# EAGLE design ARM-LPC1115_V0.30A_smd (EAGLE 6.5.0)
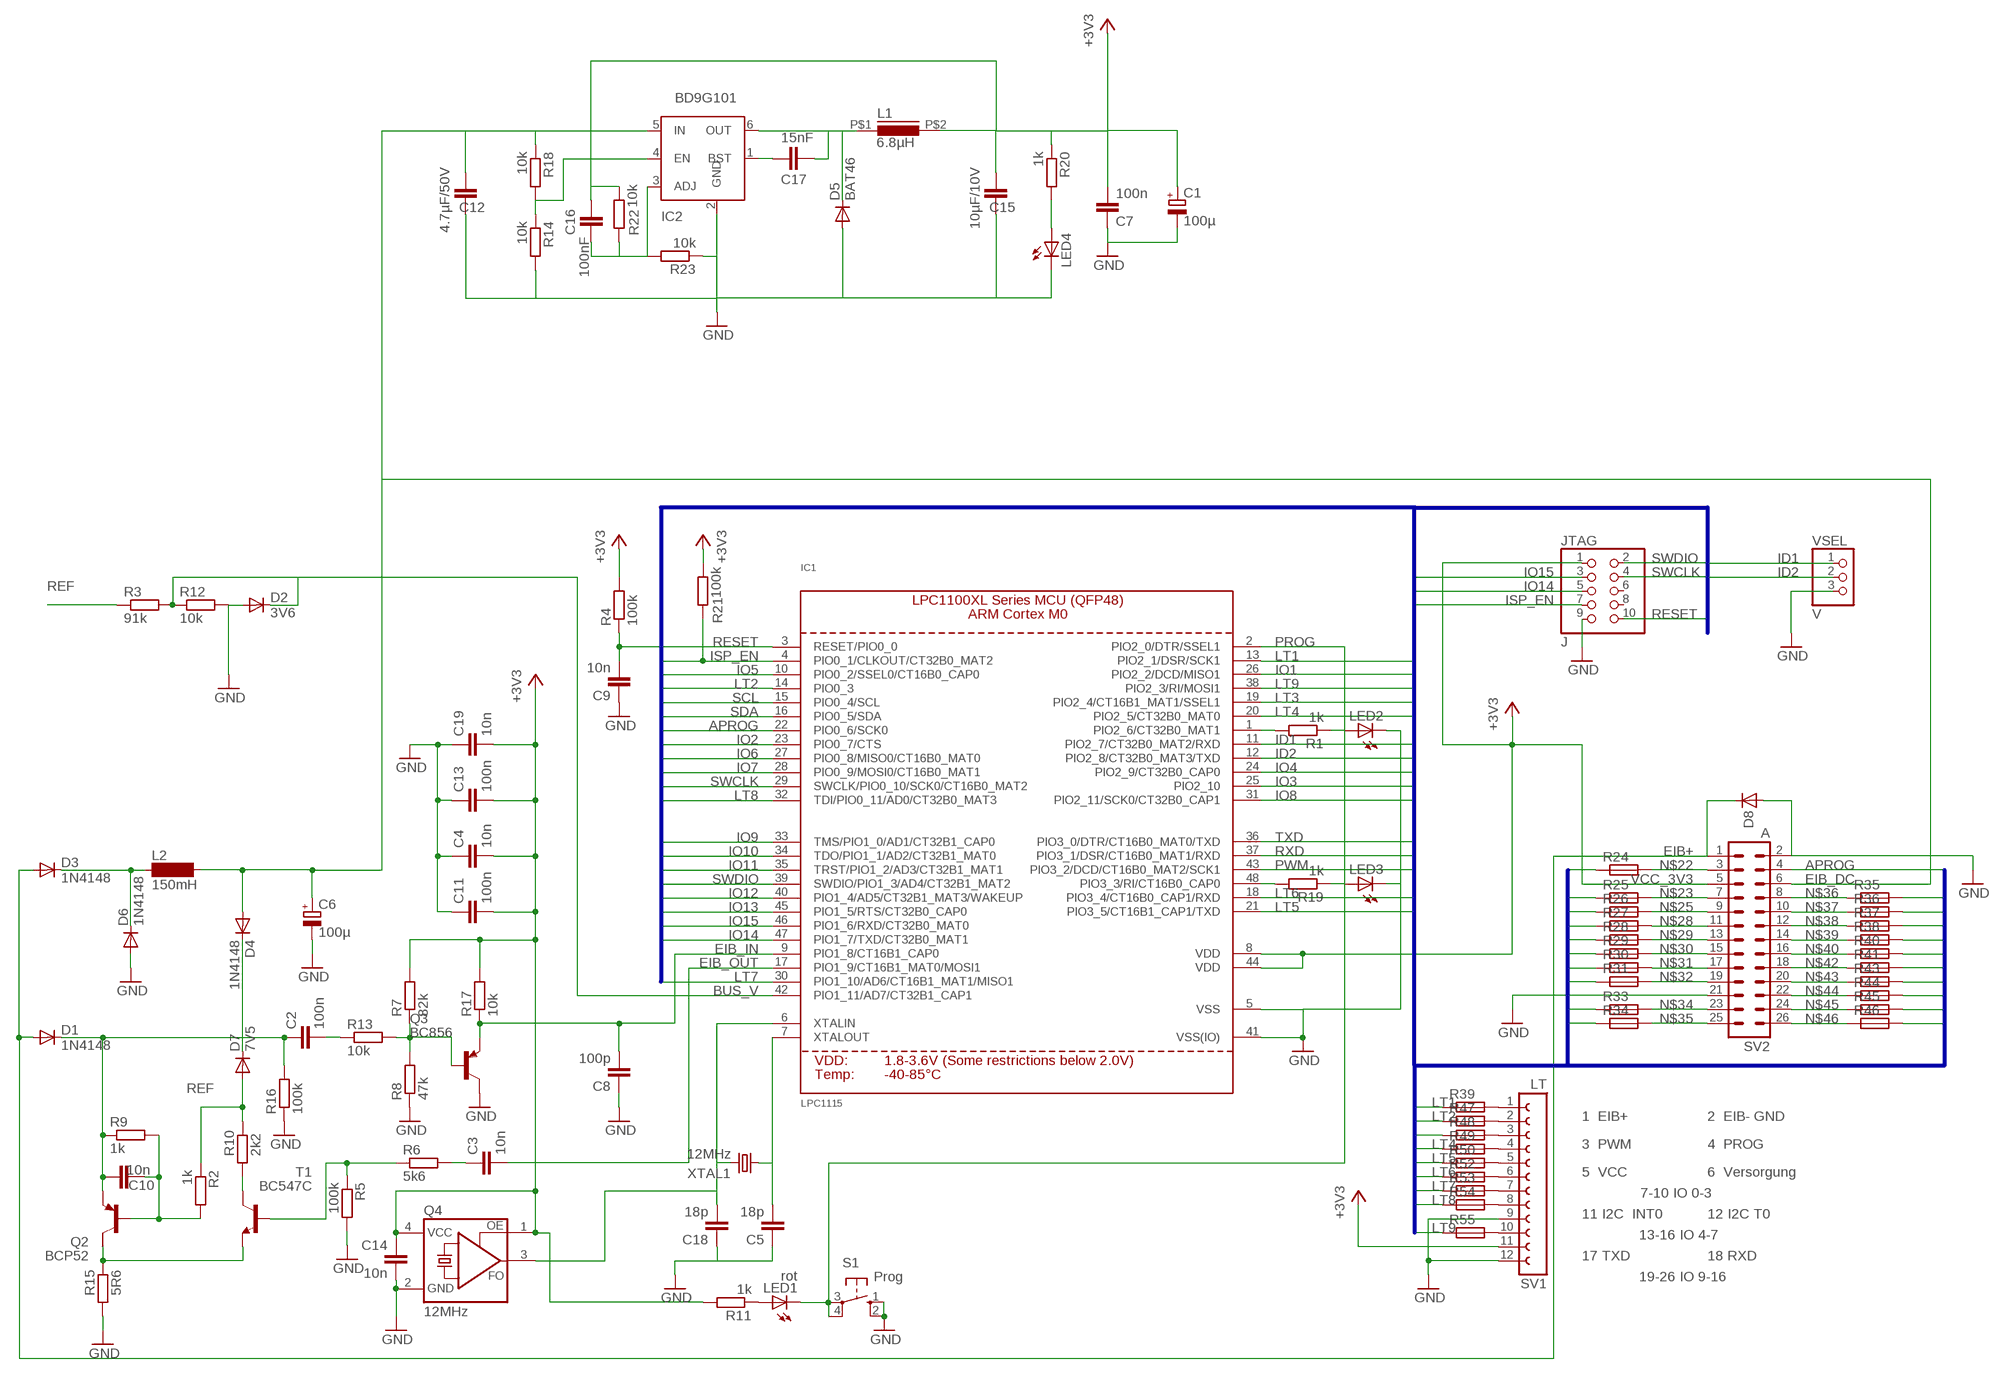
[diagram p0: schematic, sheet 1]

## Parts
C1  100µ  CPOL-EUE5-8.5  [E5-8,5]
C2  100n  C-EUC1206K  [C1206K]
C3  10n  C-EUC1206K  [C1206K]
C4  10n  C-EUC1206  [C1206]
C5  18p  C-EUC0603  [C0603]
C6  100µ  CPOL-EUE5-8.5  [E5-8,5]
C7  100n  C-EUC1206  [C1206]
C8  100p  C-EUC1206K  [C1206K]
C9  10n  C-EUC1206K  [C1206K]
C10  10n  C-EUC1206K  [C1206K]
C11  100n  C-EUC1206  [C1206]
C12  4.7µF/50V  C-EUC1206K  [C1206K]
C13  100n  C-EUC1206  [C1206]
C14  10n  C-EUC1206  [C1206]
C15  10µF/10V  C-EUC1206K  [C1206K]
C16  100nF  C-EUC1206  [C1206]
C17  15nF  C-EUC1206  [C1206]
C18  18p  C-EUC0603  [C0603]
C19  10n  C-EUC1206  [C1206]
D1  1N4148  DIODE-MINIMELF  [MINIMELF]
D2  3V6  DIODE-MINIMELF  [MINIMELF]
D3  1N4148  DIODE-MINIMELF  [MINIMELF]
D4  1N4148  DIODE-MINIMELF  [MINIMELF]
D5  BAT46  DIODE-DO214AC  [DO214AC]
D6  1N4148  DIODE-MINIMELF  [MINIMELF]
D7  7V5  DIODE-MINIMELF  [MINIMELF]
D8  D-SMB  [SMB]
IC1  LPC1115  LPC1113/4/5_QFP48_XLSERIES  [LQFP48]
IC2  BD9G101  BD9G101GBD9G101G-SOT23-6  [SOT23-6]
JTAG  J  PINHD-2X05_2.00  [2X05M]
L1  6.8µH  IND_FASTRON_1616FPS  [PIS2812]
L2  150mH  SD12-1000  [SD12_1000]
LED1  rot  LED3MM  [LED3MM]
LED2  LEDSMT1206  [1206]
LED3  LEDSMT1206  [1206]
LED4  LEDSMT1206  [1206]
Q2  BCP52  FZT753SMD  [SOT223]
Q3  BC856  BC856BSMD  [SOT23-BEC]
Q4  12MHz  ASFL  [ASF]
R1  1k  R-EU_R1206  [R1206]
R2  1k  R-EU_R1206  [R1206]
R3  91k  R-EU_R1206  [R1206]
R4  100k  R-EU_R1206  [R1206]
R5  100k  R-EU_R1206  [R1206]
R6  5k6  R-EU_R1206  [R1206]
R7  82k  R-EU_R1206  [R1206]
R8  47k  R-EU_R1206  [R1206]
R9  1k  R-EU_R1206  [R1206]
R10  2k2  R-EU_R1206  [R1206]
R11  1k  R-EU_R1206  [R1206]
R12  10k  R-EU_R1206  [R1206]
R13  10k  R-EU_R1206  [R1206]
R14  10k  R-EU_R1206  [R1206]
R15  5R6  R-EU_R1206  [R1206]
R16  100k  R-EU_R1206  [R1206]
R17  10k  R-EU_R1206  [R1206]
R18  10k  R-EU_R1206  [R1206]
R19  1k  R-EU_R1206  [R1206]
R20  1k  R-EU_R1206  [R1206]
R21  100k  R-EU_R1206  [R1206]
R22  10k  R-EU_R1206  [R1206]
R23  10k  R-EU_R1206  [R1206]
R24  R-EU_BRIDGER0603  [R0603_BRIDGE]
R25  R-EU_BRIDGER0603  [R0603_BRIDGE]
R26  R-EU_BRIDGER0603  [R0603_BRIDGE]
R27  R-EU_BRIDGER0603  [R0603_BRIDGE]
R28  R-EU_BRIDGER0603  [R0603_BRIDGE]
R29  R-EU_BRIDGER0603  [R0603_BRIDGE]
R30  R-EU_BRIDGER0603  [R0603_BRIDGE]
R31  R-EU_BRIDGER0603  [R0603_BRIDGE]
R33  R-EU_BRIDGER0603  [R0603_BRIDGE]
R34  R-EU_BRIDGER0603  [R0603_BRIDGE]
R35  R-EU_BRIDGER0603  [R0603_BRIDGE]
R36  R-EU_BRIDGER0603  [R0603_BRIDGE]
R37  R-EU_BRIDGER0603  [R0603_BRIDGE]
R38  R-EU_BRIDGER0603  [R0603_BRIDGE]
R39  R-EU_BRIDGER0603  [R0603_BRIDGE]
R40  R-EU_BRIDGER0603  [R0603_BRIDGE]
R41  R-EU_BRIDGER0603  [R0603_BRIDGE]
R43  R-EU_BRIDGER0603  [R0603_BRIDGE]
R44  R-EU_BRIDGER0603  [R0603_BRIDGE]
R45  R-EU_BRIDGER0603  [R0603_BRIDGE]
R46  R-EU_BRIDGER0603  [R0603_BRIDGE]
R47  R-EU_BRIDGER0603  [R0603_BRIDGE]
R48  R-EU_BRIDGER0603  [R0603_BRIDGE]
R49  R-EU_BRIDGER0603  [R0603_BRIDGE]
R50  R-EU_BRIDGER0603  [R0603_BRIDGE]
R52  R-EU_BRIDGER0603  [R0603_BRIDGE]
R53  R-EU_BRIDGER0603  [R0603_BRIDGE]
R54  R-EU_BRIDGER0603  [R0603_BRIDGE]
R55  R-EU_BRIDGER0603  [R0603_BRIDGE]
S1  Prog  10-XX  [B3F-10XX]
SV1  LT  FE12-1  [FE12]
SV2  A  ML26  [ML26]
T1  BC547C  BC847  [SOT23]
VSEL  V  HEADER-1X3ROUND  [1X03_ROUND]
XTAL1  12MHz  CRYSTALHC49S  [HC49/S]

## Nets
APROG: IC1.22(PIO0_6/SCK0) SV2.4
BUS_V: D2.C IC1.42(PIO1_11/AD7/CT32B1_CAP1) R3.2 R12.1
DRAIN: C2.1 C10.1 D1.C Q2.3(E) R9.1 R16.2
EIB+: D1.A D3.A D8.1(C) SV2.1
EIB_DC: C6.+ C12.2 D4.A IC2.5(IN) L2.2 R18.1 SV2.6
EIB_IN: C8.2 IC1.9(PIO1_8/CT16B1_CAP0) Q3.E R17.1
EIB_OUT: C3.2 IC1.17(PIO1_9/CT16B1_MAT0/MOSI1)
GND: C1.- C4.1 C5.1 C6.- C7.1 C8.1 C9.1 C11.1 C12.1 C13.1 C14.2 C15.1 C18.1 C19.1 D2.A D5.A D6.A D8.2(A) IC1.5(VSS) IC1.41(VSS(IO)) IC2.2(GND) JTAG.9 LED2.C LED3.C LED4.C Q3.C Q4.2(GND) R5.2 R8.1 R12.2 R14.2 R15.1 R16.1 R23.1 S1.1(S) S1.2(S1) SV1.9 SV1.12 SV2.2 SV2.21 VSEL.3
ID1: IC1.11(PIO2_7/CT32B0_MAT2/RXD) VSEL.1
ID2: IC1.12(PIO2_8/CT32B0_MAT3/TXD) VSEL.2
IO1: IC1.26(PIO2_2/DCD/MISO1) R25.1
IO2: IC1.23(PIO0_7/CTS) R35.2
IO3: IC1.25(PIO2_10) R26.1
IO4: IC1.24(PIO2_9/CT32B0_CAP0) R36.2
IO5: IC1.10(PIO0_2/SSEL0/CT16B0_CAP0) R28.1
IO6: IC1.27(PIO0_8/MISO0/CT16B0_MAT0) R38.2
IO7: IC1.28(PIO0_9/MOSI0/CT16B0_MAT1) R29.1
IO8: IC1.31(PIO2_11/SCK0/CT32B0_CAP1) R40.2
IO9: IC1.33(TMS/PIO1_0/AD1/CT32B1_CAP0) R31.1
IO10: IC1.34(TDO/PIO1_1/AD2/CT32B1_MAT0) R43.2
IO11: IC1.35(TRST/PIO1_2/AD3/CT32B1_MAT1) R44.2
IO12: IC1.40(PIO1_4/AD5/CT32B1_MAT3/WAKEUP) R33.1
IO13: IC1.45(PIO1_5/RTS/CT32B0_CAP0) R45.2
IO14: IC1.47(PIO1_7/TXD/CT32B0_MAT1) JTAG.5 R34.1
IO15: IC1.46(PIO1_6/RXD/CT32B0_MAT0) JTAG.3 R46.2
ISP_EN: IC1.4(PIO0_1/CLKOUT/CT32B0_MAT2) JTAG.7 R21.1
LT1: IC1.13(PIO2_1/DSR/SCK1) R39.1
LT2: IC1.14(PIO0_3) R47.1
LT3: IC1.19(PIO2_4/CT16B1_MAT1/SSEL1) R48.1
LT4: IC1.20(PIO2_5/CT32B0_MAT0) R49.1
LT5: IC1.21(PIO3_5/CT16B1_CAP1/TXD) R50.1
LT6: IC1.18(PIO3_4/CT16B0_CAP1/RXD) R52.1
LT7: IC1.30(PIO1_10/AD6/CT16B1_MAT1/MISO1) R53.1
LT8: IC1.32(TDI/PIO0_11/AD0/CT32B0_MAT3) R54.1
LT9: IC1.38(PIO2_3/RI/MOSI1) R55.1
LX: C17.1 D5.C IC2.6(OUT) L1.P$1
N$1: C3.1 R6.2
N$2: C2.2 R13.1
N$3: C5.2 IC1.7(XTALOUT) XTAL1.1
N$4: IC1.1(PIO2_6/CT32B0_MAT1) R1.2
N$5: IC1.48(PIO3_3/RI/CT16B0_CAP0) R19.2
N$6: R10.1 T1.3(C)
N$7: Q2.2(C) R15.2 T1.2(E)
N$8: D3.C D6.C L2.1
N$9: D4.C D7.C
N$10: LED2.A R1.1
N$11: LED3.A R19.1
N$12: R5.1 R6.1 T1.1(B)
N$13: LED4.A R20.2
N$14: Q3.B R7.1 R8.2 R13.2
N$15: C10.2 Q2.1(B) R2.2 R9.2
N$17: C18.2 IC1.6(XTALIN) Q4.3(FO) XTAL1.2
N$19: C17.2 IC2.1(BST)
N$20: IC2.4(EN) R14.1 R18.2
N$22: R24.2 SV2.3
N$23: R25.2 SV2.7
N$24: C16.1 IC2.3(ADJ) R22.1 R23.2
N$25: R26.2 SV2.9
N$28: R27.2 SV2.11
N$29: R28.2 SV2.13
N$30: R29.2 SV2.15
N$31: R30.2 SV2.17
N$32: R31.2 SV2.19
N$34: R33.2 SV2.23
N$35: R34.2 SV2.25
N$36: R35.1 SV2.8
N$37: R36.1 SV2.10
N$38: R37.1 SV2.12
N$39: R38.1 SV2.14
N$40: R40.1 SV2.16
N$41: LED1.A R11.1
N$42: R41.1 SV2.18
N$43: R43.1 SV2.20
N$44: R44.1 SV2.22
N$45: R45.1 SV2.24
N$46: R46.1 SV2.26
N$47: R39.2 SV1.1
N$48: R47.2 SV1.2
N$49: R48.2 SV1.3
N$50: R49.2 SV1.4
N$51: R50.2 SV1.5
N$52: R52.2 SV1.6
N$53: R53.2 SV1.7
N$54: R54.2 SV1.8
N$55: R55.2 SV1.10
PROG: IC1.2(PIO2_0/DTR/SSEL1) LED1.K(C) S1.3(P) S1.4(P1)
PWM: IC1.43(PIO3_2/DCD/CT16B0_MAT2/SCK1) R24.1
REF: D7.A R2.1 R3.1 R10.2
RESET: C9.2 IC1.3(RESET/PIO0_0) JTAG.10 R4.1
RXD: IC1.37(PIO3_1/DSR/CT16B0_MAT1/RXD) R41.2
SCL: IC1.15(PIO0_4/SCL) R37.2
SDA: IC1.16(PIO0_5/SDA) R27.1
SWCLK: IC1.29(SWCLK/PIO0_10/SCK0/CT16B0_MAT2) JTAG.4
SWDIO: IC1.39(SWDIO/PIO1_3/AD4/CT32B1_MAT2) JTAG.2
TXD: IC1.36(PIO3_0/DTR/CT16B0_MAT0/TXD) R30.1
VCC_3V3: C1.+ C4.2 C7.2 C11.2 C13.2 C14.1 C15.2 C16.2 C19.2 IC1.8(VDD) IC1.44(VDD) JTAG.1 L1.P$2 Q4.1(OE) Q4.4(VCC) R4.2 R7.2 R11.2 R17.2 R20.1 R21.2 R22.2 SV1.11 SV2.5 ; supply symbol labelled +3V3
Unconnected: JTAG.6 JTAG.8 Q2.4(C/)

## Buses
IO[1..15],LT[1..9],SCL,SDA,PWM,APROG,RXD,TXD,RESET,SWCLK,SWDIO,ISP_EN,ID1,ID2

## Notes on the sheet
- 1  EIB+ | 2  EIB- GND
- 3  PWM | 4  PROG
- 5  VCC | 6  Versorgung
- 7-10 IO 0-3
- 11 I2C  INT0 | 12 I2C T0
- 13-16 IO 4-7
- 17 TXD | 18 RXD
- 19-26 IO 9-16

## Library data of the parts
C1 C6 = rcl:CPOL-EU: POLARIZED CAPACITOR, European symbol
C2-C5 C7-C19 = rcl:C-EU: CAPACITOR, European symbol
D1-D7 = diode:DIODE-: DIODE
D8 = semicon-smd-ipc:D-: DIODE unfilled
IC1 = microbuilder:LPC1113/4/5_QFP48_XLSERIES: LPC1113/4/5 ARM Cortex M0 MCU (50MHz) - XL Series (FBD48/3x3) LPC1115FBD48/303: Max Frequency: 50MHz Flash: 64kB SRAM: 8kB ADC: 10-bit
IC2 = Stefan_selfbus:BD9G101G
JTAG = pinhead-2:PINHD-2X05: PIN HEADER
L1 = Stefan_selfbus:IND_FASTRON_1616FPS
L2 = inductor-neosid:SD12: INDUCTOR nominal inductance
LED1-LED4 = led:LED: LED OSRAM: - CHIPLED LG R971, LG N971, LY N971, LG Q971, LY Q971, LO R971, LY R971 LH N974, LH R974 LS Q976, LO Q976, LY Q976 LO Q996 - Hyper CHIPLED LW Q18S LB Q993, LB Q99A, LB R99A - SideLED LS A670, LO A670, LY A670, LG A670, LP A670 LB A673, LV A673, LT A673, LW A673 LH A674 LY A675 LS A676, LA A676, LO A676, LY A676, LW A676 LS A679, LY A679, LG A679 - Hyper Micro SIDELED® LS Y876, LA Y876, LO Y876, LY Y876 LT Y87S - SmartLED LW L88C, LW L88S LB L89C, LB L89S, LG L890 LS L89K, LO L89K, LY L89K LS L896, LA L896, LO L896, LY L896 - TOPLED LS T670, LO T670, LY T670, LG T670, LP T670 LSG T670, LSP T670, LSY T670, LOP T670, LYG T670 LG T671, LOG T671, LSG T671 LB T673, LV T673, LT T673, LW T673 LH T674 LS T676, LA T676, LO T676, LY T676, LB T676, LH T676, LSB T676, LW T676 LB T67C, LV T67C, LT T67C, LS T67K, LO T67K, LY T67K, LW E67C LS E67B, LA E67B, LO E67B, LY E67B, LB E67C, LV E67C, LT E67C LW T67C LS T679, LY T679, LG T679 LS T770, LO T770, LY T770, LG T770, LP T770 LB T773, LV T773, LT T773, LW T773 LH T774 LS E675, LA E675, LY E675, LS T675 LS T776, LA T776, LO T776, LY T776, LB T776 LHGB T686 LT T68C, LB T68C - Hyper Mini TOPLED® LB M676 - Mini TOPLED Santana® LG M470 LS M47K, LO M47K, LY M47K Source: http://www.osram.convergy.de - LUMILED® LXK2-PW12-R00, LXK2-PW12-S00, LXK2-PW14-U00, LXK2-PW14-V00 LXK2-PM12-R00, LXK2-PM12-S00, LXK2-PM14-U00 LXK2-PE12-Q00, LXK2-PE12-R00, LXK2-PE12-S00, LXK2-PE14-T00, LXK2-PE14-U00 LXK2-PB12-K00, LXK2-PB12-L00, LXK2-PB12-M00, LXK2-PB14-N00, LXK2-PB14-P00, LXK2-PB14-Q00 LXK2-PR12-L00, LXK2-PR12-M00, LXK2-PR14-Q00, LXK2-PR14-R00 LXK2-PD12-Q00, LXK2-PD12-R00, LXK2-PD12-S00 LXK2-PH12-R00, LXK2-PH12-S00 LXK2-PL12-P00, LXK2-PL12-Q00, LXK2-PL12-R00 Source: www.luxeon.com
Q2 = transistor-pnp:FZT753SMD: PNP Transistor
Q3 = transistor-pnp:BC856*: PNP Transistror
Q4 = crystal:ASF*: CRYSTAL CLOCK OSCILLATORS 5.0 Vdc or 3.3 Vdc - LOW PROFILE ULTRA MINIATURE CERAMIC SURFACE MOUNT Source: http://www.abracon.com/Oscillators/asf1-L-L1.pdf
R1-R23 = rcl:R-EU_: RESISTOR, European symbol
R24-R31 R33-R41 R43-R50 R52-R55 = Stefan_selfbus:R-EU_BRIDGE: RESISTOR, European symbol
S1 = switch-omron:10-XX: OMRON SWITCH
SV1 = con-lsta:FE12-1: FEMALE HEADER; OC_FARNELL: unknown; OC_NEWARK: unknown
SV2 = con-harting-ml:ML26: HARTING; OC_FARNELL: unknown; OC_NEWARK: unknown
T1 = transistor:BC847: NPN TRANSISTOR
VSEL = microbuilder:HEADER-1X3: PIN HEADER
XTAL1 = crystal:CRYSTAL: CRYSTAL

## Board
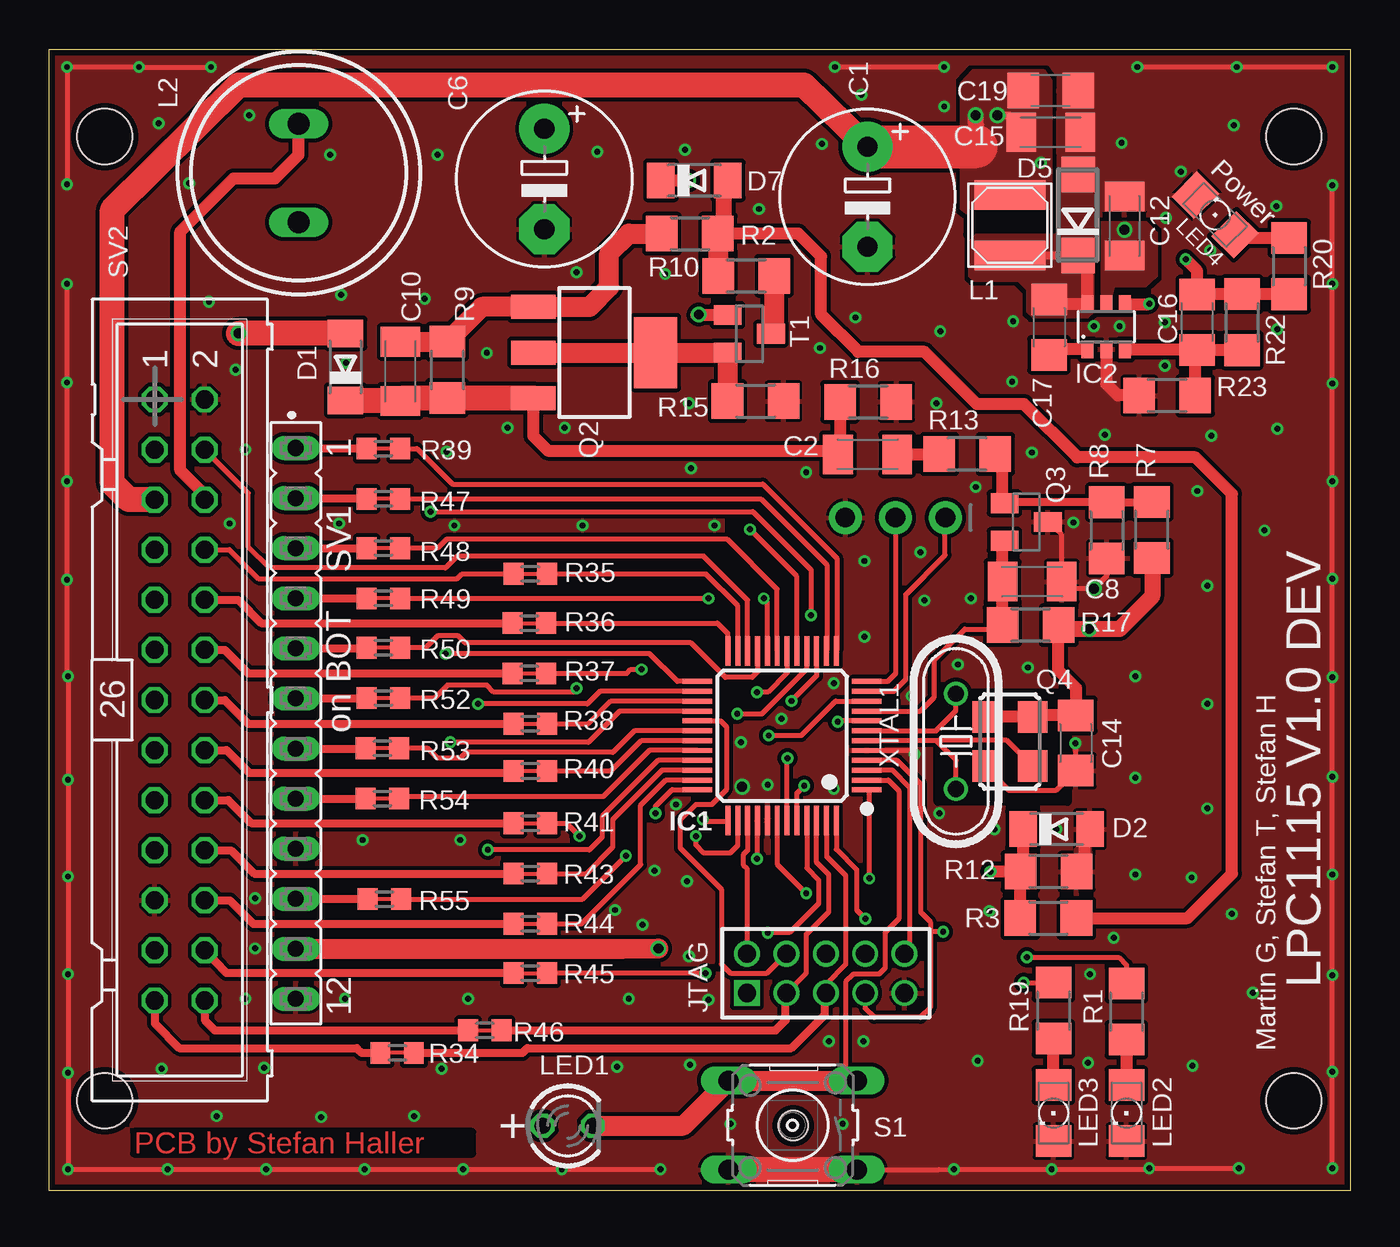
[diagram p1: board, top side]
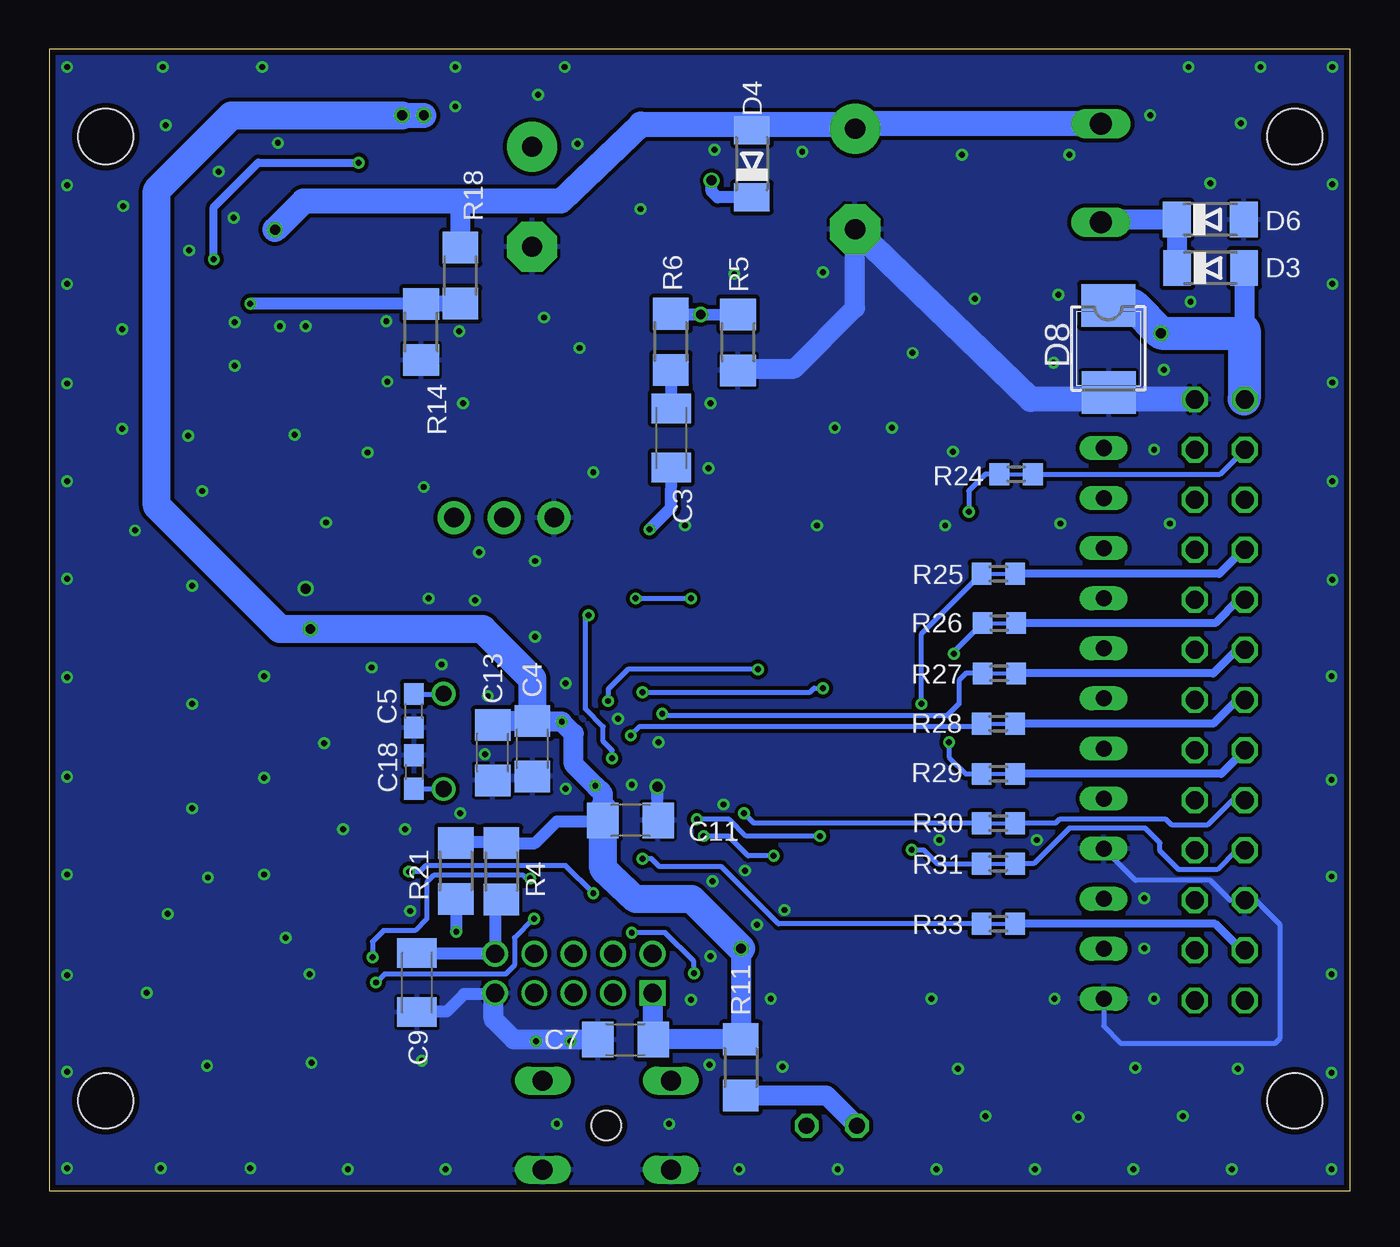
[diagram p2: board, bottom side, seen from below]

Size 66 x 57.9 mm. Coordinates in mm from the lower left corner, seen from the top.
Outline: 66,0 0,0 0,57.9 66,57.9 66,0
Copper layers (1*16): Top 0.035mm / dielectric 1.5mm / Bottom 0.035mm
Design rules "default *": minimum track width 0.16mm, minimum drill 0.3mm, track to track 0.16mm, track to pad 0.16mm, pad to pad 0.16mm, via to via 0.16mm, smd to smd 0.16mm, copper to edge 0.3mm, drill to drill 0.2mm, minimum pad ring 0.2mm, minimum via ring 0.15mm, stop-mask expansion 0.075mm, vias tented up to drill 0mil, thermal gap 0.15mm
Holes 2.8 mm at 2.81,53.48 63.14,53.48 63.14,4.58 2.81,4.58
Holes 1.5 mm at 37.73,3.31
tRestrict: area 45.1,19.7 to 51.7,25.3; area 34.6,31.1 to 37.6,34.1; area 42.5,24.8 to 42.9,24.9; area 46.7,48.5 to 50.8,49.6

### Footprints (pad centres in the part's own frame; a part is rotated, then mirrored left to right if it is on the bottom)
E5-8,5 = drill 1.016 pad 2.54: + -2.54,0 | drill 1.016 pad 2.54 octagon: - 2.54,0
C1206K = smd 1.5 x 2: 1 -1.5,0; 2 1.5,0
C1206 = smd 1.6 x 1.8: 1 -1.4,0; 2 1.4,0
C0603 = smd 1.1 x 1: 1 -0.85,0; 2 0.85,0
MINIMELF = smd 1.4 x 1.8: A 1.7,0; C -1.7,0
DO214AC = smd 1.8 x 1.7: A 2.05,0; C -2.05,0
SMB = smd 2.159 x 2.743: 1 -2.311,-0.127; 2 2.108,-0.102
LQFP48 = smd 1.5 x 0.25: 1 -4.3,2.75; 2 -4.3,2.25; 3 -4.3,1.75; 4 -4.3,1.25; 5 -4.3,0.75; 6 -4.3,0.25; 7 -4.3,-0.25; 8 -4.3,-0.75; 9 -4.3,-1.25; 10 -4.3,-1.75; 11 -4.3,-2.25; 12 -4.3,-2.75; 25 4.3,-2.75; 26 4.3,-2.25; 27 4.3,-1.75; 28 4.3,-1.25; 29 4.3,-0.75; 30 4.3,-0.25; 31 4.3,0.25; 32 4.3,0.75; 33 4.3,1.25; 34 4.3,1.75; 35 4.3,2.25; 36 4.3,2.75 | smd 0.25 x 1.5: 13 -2.75,-4.3; 14 -2.25,-4.3; 15 -1.75,-4.3; 16 -1.25,-4.3; 17 -0.75,-4.3; 18 -0.25,-4.3; 19 0.25,-4.3; 20 0.75,-4.3; 21 1.25,-4.3; 22 1.75,-4.3; 23 2.25,-4.3; 24 2.75,-4.3; 37 2.75,4.3; 38 2.25,4.3; 39 1.75,4.3; 40 1.25,4.3; 41 0.75,4.3; 42 0.25,4.3; 43 -0.25,4.3; 44 -0.75,4.3; 45 -1.25,4.3; 46 -1.75,4.3; 47 -2.25,4.3; 48 -2.75,4.3
SOT23-6 = smd 0.6 x 0.9: 1 -0.95,-1.15; 2 0,-1.15; 3 0.95,-1.15; 4 0.95,1.15; 5 0,1.15; 6 -0.95,1.15
2X05M = drill 0.914 square: 1 -4,-1 | drill 0.914: 2 -4,1; 3 -2,-1; 4 -2,1; 5 0,-1; 6 0,1; 7 2,-1; 8 2,1; 9 4,-1; 10 4,1
PIS2812 = smd 3.6 x 1.5: P$1 0,1.525; P$2 0,-1.525
SD12_1000 = drill 1.1 long: 1 -2.5,0; 2 2.5,0
LED3MM = drill 0.813 octagon: A -1.27,0; K 1.27,0
1206 = smd 1.6 x 1.803: A -1.422,0; C 1.422,0
SOT223 = smd 1.219 x 2.235: 1 -2.311,-3.099; 2 0,-3.099; 3 2.311,-3.099 | smd 3.6 x 2.2: 4 0,3.099
SOT23-BEC = smd 1 x 1.4: B -0.95,-1.1; C 0,1.1; E 0.95,-1.1
ASF = smd 1.6 x 1.5: 1 -1.25,-1.15; 2 1.25,-1.15; 3 1.25,1.15; 4 -1.25,1.15
R1206 = smd 1.6 x 1.803: 1 -1.422,0; 2 1.422,0
R0603_BRIDGE = smd 1 x 1.1: 1 -0.85,0; 2 0.85,0
B3F-10XX = drill 1.016 long: 1 -3.251,2.261; 2 3.251,2.261; 3 -3.251,-2.261; 4 3.251,-2.261
FE12 = drill 0.813 long: 1 -13.97,0; 2 -11.43,0; 3 -8.89,0; 4 -6.35,0; 5 -3.81,0; 6 -1.27,0; 7 1.27,0; 8 3.81,0; 9 6.35,0; 10 8.89,0; 11 11.43,0; 12 13.97,0
ML26 = drill 0.914 octagon: 1 -15.24,-1.27; 2 -15.24,1.27; 3 -12.7,-1.27; 4 -12.7,1.27; 5 -10.16,-1.27; 6 -10.16,1.27; 7 -7.62,-1.27; 8 -7.62,1.27; 9 -5.08,-1.27; 10 -5.08,1.27; 11 -2.54,-1.27; 12 -2.54,1.27; 13 0,-1.27; 14 0,1.27; 15 2.54,-1.27; 16 2.54,1.27; 17 5.08,-1.27; 18 5.08,1.27; 19 7.62,-1.27; 20 7.62,1.27; 21 10.16,-1.27; 22 10.16,1.27; 23 12.7,-1.27; 24 12.7,1.27; 25 15.24,-1.27; 26 15.24,1.27
SOT23 = smd 1 x 1.4: 1 -0.95,-1.1; 2 0.95,-1.1; 3 0,1.1
1X03_ROUND = drill 1 pad 1.676: 1 -2.54,0; 2 0,0; 3 2.54,0
HC49/S = drill 0.813: 1 -2.413,0; 2 2.413,0

### Placement (x,y rotation side)
C1  41.51,50.43 270 top
C2  41.51,37.35 0 top
C3  34.44,38.19 270 bottom
C4  41.48,22.43 90 bottom
C5  47.5,24.35 90 bottom
C6  25.11,51.32 270 top
C7  36.77,7.68 0 bottom
C8  49.86,30.9 180 top
C9  47.35,10.57 90 bottom
C10  17.81,41.57 90 top
C11  36.51,18.79 180 bottom
C12  54.55,48.94 270 top
C13  43.5,22.23 90 bottom
C14  52.08,22.72 270 top
C15  50.8,53.69 180 top
C16  58.24,44.06 90 top
C17  50.72,43.8 270 top
C18  47.5,21.25 270 bottom
C19  50.8,55.8 180 top
D1  15.02,41.8 90 top
D2  51.1,18.35 0 top
D3  7.08,46.81 0 bottom
D4  30.36,52.1 90 bottom
D5  52.2,49.5 90 top
D6  7.1,49.27 0 bottom
D7  32.73,51.25 0 top
D8  12.15,42.6 270 bottom
IC1  37.18,23.09 180 top
IC2  53.62,43.83 0 top
JTAG  39.39,11.04 0 top
L1  48.74,48.98 180 top
L2  12.65,51.63 90 top
LED1  26.3,3.31 0 top
LED2  54.65,3.95 270 top
LED3  50.95,3.95 270 top
LED4  59.15,49.5 135 top
Q2  27.65,42.52 270 top
Q3  49.56,33.93 270 top
Q4  48.73,22.8 270 top
R1  54.65,9.1 90 top
R2  32.5,48.55 180 top
R3  50.68,13.84 180 top
R4  43.06,16.21 90 bottom
R5  31.06,43.03 270 bottom
R6  34.46,43.07 270 bottom
R7  55.94,33.53 270 top
R8  53.65,33.51 90 top
R9  20.19,41.65 90 top
R10  35.35,46.41 180 top
R11  30.91,6.27 90 bottom
R12  50.7,16.2 0 top
R13  46.57,37.38 0 top
R14  47.14,43.56 270 bottom
R15  35.83,40.05 180 top
R16  41.55,40.02 180 top
R17  49.79,28.7 0 top
R18  45.14,46.42 270 bottom
R19  50.95,9.15 90 top
R20  62.9,46.9 90 top
R21  45.37,16.23 90 bottom
R22  60.51,44.06 90 top
R23  56.72,40.34 0 top
R24  16.95,36.35 0 bottom
R25  17.85,31.3 0 bottom
R26  17.8,28.8 0 bottom
R27  17.8,26.25 0 bottom
R28  17.85,23.7 0 bottom
R29  17.85,21.15 0 bottom
R30  17.85,18.65 0 bottom
R31  17.85,16.6 0 bottom
R33  17.85,13.55 0 bottom
R34  17.65,7 180 top
R35  24.4,31.3 0 top
R36  24.35,28.8 0 top
R37  24.35,26.25 0 top
R38  24.4,23.7 0 top
R39  16.95,37.65 180 top
R40  24.4,21.3 0 top
R41  24.4,18.65 0 top
R43  24.4,16.1 0 top
R44  24.4,13.55 0 top
R45  24.4,11.05 0 top
R46  22.1,8.15 0 top
R47  16.95,35.1 180 top
R48  16.95,32.6 180 top
R49  16.95,30.05 180 top
R50  16.95,27.55 180 top
R52  16.95,25 180 top
R53  16.9,22.45 180 top
R54  16.9,19.9 180 top
R55  17,14.8 180 top
S1  37.72,3.34 180 top
SV1  12.51,23.71 270 top
SV2  6.62,24.9 270 top
T1  35.51,43.47 270 top
VSEL  42.92,34.15 180 top
XTAL1  46,22.8 270 top

### Tracks (layer width: path | path; a pad name or v marks a point on that pad's centre or on a via)
APROG
  Top 0.254: IC1.22 35.43,29.97 33.2,32.2 20.7,32.2 20.1,31.6 11.15,31.6 10.1,32.65 10.1,35.39 SV2.4
BUS_V  (via drill 0.3)
  Top 0.254: IC1.42 36.93,16.57 v38.4,15.1
  Top 0.61: R3.2 49.26,16.18 R12.1 49.3,16.2 v47.75,16.2 | D2.C 49.4,16.32
  Top 1.016: 49.4,16.32 R12.1
  Bottom 0.254: v38.4,15.1 39.8,16.5 46.9,16.5 47.2,16.2 v47.75,16.2
DRAIN
  Top 0.61: Q2.3 24.56,38.29 25.3,37.55 39.81,37.55 C2.1 40.12,37.46 R16.2
  Top 1.016: 20.21,40.21 R9.1
  Top 1.27: Q2.3 20.21,40.21 17.95,40.21 C10.1 17.79,40.1 D1.C
EIB+  (via drill 0.5)
  Top 1.016: v9.6,43.5
  Top 1.27: D1.A v9.6,43.5
  Bottom 1.016: D3.A 5.38,43.65 5.53,43.5 | 5.38,40.17 SV2.1
  Bottom 1.676: 5.38,43.65 5.38,40.17 | 5.53,43.5 v9.6,43.5 11.01,44.91 D8.1
EIB_DC  (via drill 0.5)
  Top 0.61: SV2.6 7.89,35.31 6.65,36.55 6.65,48.65 9.35,51.35 11.45,51.35 12.65,52.55 L2.2
  Bottom 1.016: R18.1 45.14,50.19
  Bottom 1.27: L2.2 25.1,54.13 25.11,54.11 | R18.1 | 45.15,50.2 40.05,50.2 35.99,54.11 35.98,54.1 30.5,54.1 | 45.15,50.2 53.1,50.2 v54.55,48.75 | 45.14,50.19 45.15,50.2 | D4.A 30.5,53.94 30.5,54.1 | 25.11,54.11 C6.+ | 30.5,54.1 25.12,54.1 25.11,54.11
  pour Top (no thermals): 53.4,45.1 53.4,49.15 55.65,49.15 56.2,48.6 56.2,46.4 55.6,45.85 54,45.85 53.8,45.1
EIB_IN
  Top 0.254: IC1.9 44.19,24.34 44.9,25.05 44.9,26.95 46.45,28.5 48.36,28.5 R17.1 | C8.2 | 48.37,32.93 Q3.E
  Top 0.61: R17.1 C8.2 | C8.2 48.37,32.93
EIB_OUT  (via drill 0.3)
  Top 0.254: IC1.17 37.93,31.17 v35.55,33.55
  Bottom 0.61: v35.55,33.55 34.45,34.65 C3.2
GND  (via drill 0.3, 0.5)
  Top 0.254: C14.2 51.06,20.3 48.7,20.3 47.45,21.55 Q4.2 arc-90 47.08,21.84 47.05,21.9 | 50.66,33.98 Q3.C 51.37,33.27 C8.1 51.72,30.55 v53,30.55 53.65,31.2 R8.1 | 52.4,21 C14.2 | C14.2 52.08,22.82 v52.05,22.7 | IC1.5 43.71,22.34 v43.9,22.15 | S1.1 45.12,1.08 v45.9,1.1 v50.85,1.1 55.8,1.1 v55.8,1.15 v60.35,1.15 | v65.1,1.15 v65.1,10.95 v65.1,16.05 v65.1,21 v65.1,26.05 v65.1,31.05 v65.1,36 v65.1,40.95 v65.1,46 v65.1,51 | v65.1,57 v60.25,57 v55.2,57 | v45.4,57 v39.85,57 | v0.9,51.05 v0.9,57 v4.55,57 v8.2,57 | v0.9,46 v0.9,41 v0.9,36 v0.9,31 0.9,26.1 v0.95,26.1 v0.95,20.85 v0.95,15.95 v0.95,11 v0.95,6 v0.95,1.1 v6,1.1 v11,1.1 v16,1.1 v21,1.1 v26,1.1 v31,1.1
  Top 0.61: R23.1 55.28,40.35 54.2,40.35 53.62,40.93 IC2.2 | D2.A 52.8,17.95 52.5,17.65 52.5,16.58 R12.2
  Top 1.27: S1.1 S1.2
  Bottom 0.254: SV1.9 10.9,15.75 7.1,15.75 6.09,14.74 SV2.21 4.8,14.74 3.55,13.49 3.55,7.75 3.8,7.5 11.65,7.5 12.51,8.36 SV1.12
  Bottom 0.406: D8.2 12.05,40.49 12.05,40.14
  Bottom 0.61: C11.1 35.15,18.83 v35.15,20.5 | 43.45,9.98 44.97,9.98 45.85,9.1 47.38,9.1 C9.1
  Bottom 1.016: C7.1 42.43,7.68 43.45,8.7 43.45,9.98 JTAG.9 | R5.2 30.97,41.7 28.2,41.7 25.11,44.79 C6.-
  Bottom 1.27: SV2.2 12.05,40.14 16.22,40.14 C6.-
  other vias: 39.8,25.75 37.15,23.95 39.8,20.4 41.35,28.1 44.2,32.4 46.75,30.05 51.95,33.9 49.65,26.55 45.15,19.15 51.1,18.35 57.95,15.9 60,14.05 54,12.85 52.8,11 58.75,30.7 61.65,33.5 58.25,35.5 58.95,38.3 53.55,38.35 48.85,41.05 49.85,37.45 45,39.95 45.2,43.6 39.1,42.75 40.9,44.3 36,49.8 32.25,52.8 39.2,53.1 45.4,55 65.1,6.05 41.2,55.6 10.15,54.55 7.1,51.1 8.1,45.1 14.25,52.55 19.7,52.55 27.8,52.7 14.8,45.45 19.05,45.25 15.05,42 22.2,42.5 31.25,46.5 32.45,39.95 23.25,38.7 32.55,36.65 38.4,36.45 47,35.7 47.95,18.35 58.75,19.4 58.75,24.7 58,6.35 61.05,10.05 52.7,6.5 47.1,6.6 40.25,3.4 34.55,3.4 33.45,9.7 32.35,15.7 29.4,9.75 15,9.75 9.95,9.75 21.25,9.75 28.8,6.3 19.9,6.2 10.9,6.25 8.5,3.8 13.8,3.75 18.5,3.8 5.7,6.2 9.15,33.85 10.45,12.3 9.95,37.6 58.9,47.7 57.4,51.7 53,43.85 54.3,43.85 56.6,44.05 56.65,49.35 48.9,44.1 56.6,41.85 62.3,38.65 62.3,43.7 62.25,49.95 60.1,54.05 5.55,54.15 26.75,46.6 26.15,38.7 33.75,33.75 20.55,33.75 14.7,33.85 36.45,20.6 35.1,22.75 47.7,14.2 9.45,41.65 27.05,33.75 31.8,19.6 32.45,11.9 55.1,20.95 55.1,26.1 55.1,16.05 41.3,7.6 39.55,7.6 32.5,6.4 20.85,17.8 15.9,17.8 30.1,13.5 30.7,16.25 28.7,14.25 10.45,14.85 46.1,26.7 43.75,25.1 44.4,29.95 41.35,31.95 20.15,37.5 54.4,53.15
  pour Top (no thermals): 51.15,56.95 51.15,50.15 51.65,49.7 55.6,49.7 56,50.1 56,54.15 53.65,56.95
  pour Bottom (isolate 0.2, rank 6): -0.75,58.45 -0.9,-1.05 66.8,-1.05 66.7,58.6
  pour Top (isolate 0.2, rank 6): -0.75,58.45 -0.9,-1.05 66.8,-1.05 66.7,58.6
ID1
  Top 0.254: IC1.11 42.84,25.34 43.45,25.95 43.45,30.25 45.45,32.25 45.45,34.09 VSEL.1
ID2
  Top 0.254: IC1.12 42.54,25.84 42.95,26.25 42.95,34.02 VSEL.2
IO1  (via drill 0.3)
  Top 0.254: IC1.26 27.94,25.34 27.3,24.7 v21.75,24.7
  Bottom 0.254: v21.75,24.7 21.75,28.25 R25.1
IO2
  Top 0.254: R35.2 33.3,31.3 34.93,29.67 IC1.23
IO3  (via drill 0.3)
  Top 0.254: IC1.25 31.86,25.84 30.45,27.25 v20.1,27.25
  Bottom 0.254: v20.1,27.25 19.95,27.5 R26.1
IO4
  Top 0.254: R36.2 33.9,28.8 34.43,28.27 IC1.24
IO5  (via drill 0.3)
  Top 0.254: v36.5,23.1 38.15,23.1 39.89,24.84 IC1.10
  Bottom 0.254: R28.1 18.85,23.55 36.05,23.55 v36.5,23.1
IO6
  Top 0.254: R38.2 27.35,23.7 28.5,24.85 32.82,24.85 IC1.27
IO7  (via drill 0.3)
  Top 0.254: IC1.28 28.94,24.34 27.35,22.75 v20.35,22.75
  Bottom 0.254: v20.35,22.75 20.35,22 19.5,21.15 R29.1
IO8
  Top 0.254: R40.2 28.5,21.3 30.05,22.85 32.84,22.85 IC1.31
IO9  (via drill 0.3)
  Top 0.254: IC1.33 30.89,21.84 28.05,19 28.05,17.95 27.4,17.3 v22.25,17.3
  Bottom 0.254: v22.25,17.3 21.65,17.3 20.95,16.6 R31.1
IO10
  Top 0.254: R43.2 27.25,16.1 28.6,17.45 28.6,18.85 31.1,21.35 IC1.34
IO11
  Top 0.254: R44.2 27,13.55 30,16.55 30,19.55 31.3,20.85 IC1.35
IO12  (via drill 0.3)
  Top 0.254: 35.9,18.76 IC1.40 35.93,17.02 v35.9,16.85
  Bottom 0.254: v35.9,16.85 35.45,16.85 35.05,16.45 31.9,16.45 29,13.55 R33.1
IO13  (via drill 0.3)
  Top 0.254: v33.3,11.05 R45.2 | v36.45,13.1 37.55,13.1 39.03,14.58 39.03,15.77 38.43,16.37 IC1.45
  Bottom 0.254: v33.3,11.05 33.3,11.65 34.75,13.1 v36.45,13.1
IO14
  Top 0.254: IC1.47 39.43,16.97 40.4,16 40.4,11.5 39.39,10.49 JTAG.5
  Top 0.406: 39.35,10 39.35,8.95 37.65,7.25 24.25,7.25 24,7 R34.1
  Top 0.813: 39.35,10 JTAG.5
IO15
  Top 0.254: IC1.46 38.93,16.67 39.55,16.05 39.55,14.15 38.4,13 38.4,11.05 JTAG.3
  Top 0.406: R46.2 36.85,8.15 37.35,8.65 37.35,10
  Top 0.813: 37.35,10 JTAG.3
ISP_EN  (via drill 0.3)
  Top 0.254: IC1.4 43.01,21.84 44.2,20.65 44.2,14.15 44.7,13.65 44.7,13.1 | 44.7,13.1 44.7,9.3 44.2,8.8 41.85,8.8 41.4,9.25 JTAG.7 | v45.35,13.15 44.75,13.15 44.7,13.1
  Bottom 0.61: R21.1 45.37,13.17 v45.35,13.15
LT1
  Top 0.254: R39.1 18.65,37.65 20.45,35.85 36.2,35.85 39.95,32.1 39.95,27.41 IC1.13
LT2
  Top 0.254: R47.1 36.1,35.1 39.45,31.75 39.45,27.41 IC1.14
LT3
  Top 0.254: IC1.19 36.93,30.52 34.4,33.05 20.15,33.05 19.7,32.6 R48.1
LT4  (via drill 0.3)
  Top 0.254: IC1.20 36.43,29.87 v36.25,30.05 | R49.1 v33.45,30.05
  Bottom 0.254: v36.25,30.05 v33.45,30.05
LT5
  Top 0.254: IC1.21 35.93,26.33 35.65,26.05 34.3,26.05 32.55,27.8 21.1,27.8 20.75,28.15 19.7,28.15 19.1,27.55 R50.1
LT6  (via drill 0.3)
  Top 0.254: IC1.18 37.43,26.28 36.45,25.3 v35.9,25.3 | v26.75,25.5 26.75,25.3 22.55,25.3 22.2,25.65 20.2,25.65 19.55,25 R52.1
  Bottom 0.254: v35.9,25.3 27.4,25.3 27.2,25.5 v26.75,25.5
LT7
  Top 0.254: IC1.30 29.69,23.34 28.6,22.25 21.15,22.25 20.85,21.95 19.7,21.95 19.2,22.45 R53.1
LT8
  Top 0.254: IC1.32 30.44,22.34 28.1,20 17.85,20 R54.1
LT9  (via drill 0.3)
  Top 0.254: R55.1 27.05,14.8 v29.25,17 | v32.8,18 32.8,17.55 33.2,17.15 34.55,17.15 34.93,17.53 IC1.38
  Bottom 0.254: v29.25,17 30.55,17 31.55,18 v32.8,18
LX
  Top 0.254: 51.1,44.98 C17.1
  Top 0.406: 52.67,47.13 D5.C 52.05,47.45 L1.P$1
  Top 0.61: 51.1,44.98 IC2.6 52.67,47.13
  pour Top (no thermals): 53,44.9 53,48.45 52.95,48.5 47,48.5 46.65,48.15 46.65,46.4 46.9,46.15 49.15,46.15 49.6,45.7 49.6,44.6 49.9,44.3 52.7,44.3 53,44.6
N$1
  Bottom 0.254: 34.44,41.63 R6.2
  Bottom 0.61: C3.1 34.44,41.63
N$2
  Top 0.61: C2.2 43.04,37.38 R13.1
N$3
  Top 0.254: IC1.7 44.99,23.34 45.99,24.35 XTAL1.1
  Bottom 0.254: C5.2 46.01,25.2 XTAL1.1
N$4  (via drill 0.3)
  Top 0.254: v41.6,15.85 41.6,20.34 IC1.1 | v49.6,11.85 54.25,11.85 54.65,11.45 R1.2
  Bottom 0.254: v41.6,15.85 41.8,15.85 41.95,16 46.5,16 46.85,15.65 46.85,13.8 47.45,13.2 49.05,13.2 49.6,12.65 v49.6,11.85
N$5  (via drill 0.3)
  Top 0.254: IC1.48 39.93,17.32 40.95,16.3 40.95,14.25 v41.4,13.8 | v49.43,10.57 R19.2
  Bottom 0.254: v41.4,13.8 41.45,13.8 42.4,12.85 42.4,11.45 42.85,11 49,11 v49.43,10.57
N$6
  Top 1.016: R10.1 36.78,43.64 T1.3
N$7
  Top 0.61: T1.2
  Top 1.016: Q2.2 T1.2 | T1.2 R15.2
N$8
  Bottom 1.016: D3.C 8.78,49.25 D6.C 12.51,49.27 L2.1
N$9  (via drill 0.5)
  Top 0.61: D7.C 32.35,51.25 v32.4,51.25
  Bottom 0.61: D4.C 32.1,50.4 32.4,50.7 v32.4,51.25
N$10
  Top 0.61: R1.1 LED2.A
N$11
  Top 0.61: LED3.A R19.1
N$12  (via drill 0.5)
  Top 0.61: T1.1 32.83,44.42 v32.95,44.45
  Bottom 0.61: R6.1 34.63,44.44 R5.1 34.61,44.45 v32.95,44.45
N$13
  Top 0.61: R20.2 60.33,48.32 LED4.A
N$14
  Top 0.254: 55.81,34.93 R7.1
  Top 0.406: 55.81,34.93 R8.2 48.46,34.93 Q3.B
  Top 0.61: Q3.B 48.35,35.04 48.35,36.85 47.99,37.21 R13.2
N$15
  Top 1.016: C10.2 R9.2 21.96,44.83 Q2.1 27.4,44.83 28.4,45.85 28.4,47.55 29.4,48.55 R2.2
N$17
  Top 0.254: 44.99,22.84 IC1.6 | XTAL1.2 46,21.83 44.99,22.84 | Q4.3 48.58,22.85 45.1,22.85 45.24,22.84 44.99,22.84
  Bottom 0.254: C18.2 46.01,20.4 XTAL1.2
N$19
  Top 0.254: 51.05,42.68 C17.2
  Top 0.61: IC2.1 51.05,42.68
N$20  (via drill 0.3)
  Top 0.61: IC2.4 55.78,44.98 v55.8,45
  Bottom 0.61: R18.2 v55.8,45
  Bottom 0.813: R14.1 45.16,44.99 R18.2
N$22
  Bottom 0.254: R24.2 6.6,36.35 SV2.3
N$23
  Bottom 0.406: SV2.7 5.43,32.52 6.65,31.3 R25.2
N$24
  Top 0.254: 60.48,42.66 R22.1 | 54.59,42.66 IC2.3 | 58.14,42.56 C16.1
  Top 0.61: 60.48,42.66 C16.1 54.59,42.66 | R23.2 58.14,42.56
N$25
  Bottom 0.406: SV2.9 5.67,29.98 6.85,28.8 R26.2
N$28
  Bottom 0.406: SV2.11 5.76,27.44 6.95,26.25 R27.2
N$29
  Bottom 0.406: SV2.13 5.75,24.9 6.95,23.7 R28.2
N$30
  Bottom 0.406: SV2.15 6.55,21.15 R29.2
N$31
  Bottom 0.254: SV2.17 5.98,19.82 7.25,18.55 9.05,18.55 9.35,18.85 14.75,18.85 14.95,18.65 R30.2
N$32
  Bottom 0.254: SV2.19 5.77,17.28 6.75,16.3 8.7,16.3 9.65,17.25 9.65,17.65 10.4,18.4 14.25,18.4 16.05,16.6 R31.2
N$34
  Bottom 0.254: 5.55,12.2 SV2.23
  Bottom 0.406: 5.55,12.2 5.55,12.25 6.85,13.55 R33.2
N$35
  Top 0.406: SV2.25 5.35,8.5 6.6,7.25 15.6,7.25 15.85,7 R34.2
N$36
  Top 0.254: SV2.8 9.13,32.52 10.6,31.05 20.7,31.05 20.95,31.3 R35.1
N$37
  Top 0.406: SV2.10 9.57,29.98 10.75,28.8 R36.1
N$38
  Top 0.406: SV2.12 8.91,27.44 10.1,26.25 R37.1
N$39
  Top 0.406: SV2.14 8.9,24.9 10.1,23.7 R38.1
N$40
  Top 0.406: SV2.16 8.99,22.36 10.15,21.2 23.45,21.2 R40.1
N$41
  Bottom 1.016: R11.1 26.58,4.85 LED1.A
N$42
  Top 0.406: SV2.18 9.08,19.82 10.25,18.65 R41.1
N$43
  Top 0.406: SV2.20 9.22,17.28 10.4,16.1 R43.1
N$44
  Top 0.406: SV2.22 9.16,14.74 10.35,13.55 R44.1
N$45
  Top 0.406: R45.1 8.99,11.05 SV2.24
N$46
  Top 0.406: SV2.26 7.89,8.66 8.4,8.15 R46.1
N$47
  Top 0.406: R39.2 12.54,37.65 SV1.1
N$48
  Top 0.406: SV1.2 16.06,35.14 R47.2
N$49
  Top 0.406: SV1.3 R48.2
N$50
  Top 0.406: SV1.4 R49.2
N$51
  Top 0.406: SV1.5 16.07,27.52 R50.2
N$52
  Top 0.406: SV1.6 16.08,24.98 R52.2
N$53
  Top 0.406: SV1.7 R53.2
N$54
  Top 0.406: SV1.8 R54.2
N$55
  Top 0.406: SV1.10 16.13,14.82 R55.2
PROG
  Top 0.254: IC1.2 42.56,20.84 43.1,20.3 43.1,13.8 42.4,13.1 42.4,11.3 42.1,11 40.8,11 40.4,10.6 40.4,6.17 S1.3
  Top 1.016: LED1.K 32.17,3.31 S1.4 S1.3
PWM  (via drill 0.3)
  Top 0.254: IC1.43 37.43,21.92 v37.45,21.95 | v19.35,34.45 35.7,34.45 38.65,31.5 v38.65,29.2
  Bottom 0.254: R24.1 18.5,36.35 19.35,35.5 v19.35,34.45 | v37.45,21.95 37.45,22.35 37.9,22.8 37.9,23.55 38.8,24.45 38.8,29.05 v38.65,29.2
REF
  Top 0.61: R3.1 57.74,13.84 60,16.1 60,35.35 58.15,37.2 52.15,37.2 49.45,39.9 47.05,39.9 44.4,42.55 41.05,42.55 39.15,44.45 39.15,47.4 38,48.55 R2.1 34.2,48.84 | D7.A 34.2,51.25
  Top 0.813: 34.2,51.25 34.2,48.84
  Top 1.016: R2.1 33.92,46.42 R10.2 | R2.1
RESET
  Top 0.254: IC1.3 42.75,21.35 43.65,20.45 43.65,12.3 JTAG.10
  Bottom 0.254: R4.1 43.39,14.72 43.42,14.75
  Bottom 0.61: 43.39,14.72 JTAG.10 43.43,12.05 47.15,12.05 47.57,12.47 C9.2
RXD  (via drill 0.3)
  Top 0.254: R41.2 26.25,18.65 v26.9,18 | v33.15,18.85 33.3,18.75 34.39,18.75 IC1.37
  Bottom 0.254: v26.9,18 30.65,18 31.5,18.85 v33.15,18.85
SCL  (via drill 0.3)
  Top 0.254: R37.2 29.3,26.25 29.5,26.45 v30.05,26.45 | IC1.15 38.93,26.13 v37.65,24.85
  Bottom 0.254: v30.05,26.45 36.65,26.45 37.65,25.45 v37.65,24.85
SDA  (via drill 0.3)
  Top 0.254: v34.9,24.2 36.15,24.2 38.43,26.48 IC1.16
  Bottom 0.254: R27.1 19.5,26.25 19.85,25.9 19.85,24.7 20.45,24.1 34.75,24.1 v34.9,24.2
SWCLK
  Top 0.254: IC1.29 34.06,23.84 34.35,23.55 34.35,20.35 33.6,19.6 32.8,19.6 32,18.8 32,17.4 34.1,15.3 34.1,11.5 34.55,11.05 36.4,11.05 JTAG.4
SWDIO
  Top 0.254: IC1.39 35.43,17.28 35.2,17.05 35.2,16.55 35.39,16.36 JTAG.2
TXD  (via drill 0.3)
  Top 0.254: IC1.36 32.84,20.35 31.6,20.35 30.75,19.5 v30.75,19.15
  Bottom 0.254: R30.1 30.25,18.65 v30.75,19.15
VCC_3V3  (via drill 0.3, 0.5)
  Top 0.254: 49.5,24.12 Q4.4 | IC1.8 40.09,23.84 v40,23.8 | 47.39,23.84 47.55,24 47.53,24 Q4.1 | 58.26,45.48 C16.2 | IC1.44 37.93,20.18 v38.3,20.55
  Top 0.406: v48.1,54.55 48.7,54.55 C15.2
  Top 0.61: 49.5,24.12 C14.1 52.1,24.14 52.1,25.5 51.2,26.4 51.2,28.49 R17.2 | Q4.4 Q4.1 | 58.26,45.48 R22.2 R20.1 | C16.2 58.24,46.66 v57.65,47.25
  Top 0.813: R7.2 55.95,32.14 55.95,30.15 54.3,28.5 v52.75,28.5 51.21,28.5 R17.2 | 47.03,52.97 47.05,52.85 v47,54.55
  Top 1.016: SV1.11 29.07,12.28 v30.9,12.3
  Top 1.27: SV2.5 4.04,35.06 3.2,35.9 3.2,49.75 9.6,56.1 38.28,56.1 C1.+
  Top 2.184: C1.+ 47.03,52.97
  Bottom 0.254: 41.45,23.8 C4.2 | 37.97,18.75 37.96,18.75 C11.2
  Bottom 0.406: v57.65,47.25 57.65,49.9 55.4,52.15 v50.3,52.15
  Bottom 0.61: 37.97,18.75 40.25,18.75 41.36,17.64 R4.2 43.1,17.68 45.35,17.68 R21.2
  Bottom 1.016: JTAG.1 35.37,10.02 C7.2 35.35,7.69 R11.2 30.9,7.71 v30.9,12.3 | 41.45,23.8 v40,23.8 39.4,23.2 39.4,21.65 v38.3,20.55 37.91,20.16 37.91,19.35 | C11.2 37.91,19.35 | 37.9,19.34 37.91,19.35 | 41.51,23.83 43.27,23.83 43.4,23.7 C13.2
  Bottom 1.27: C4.2 41.49,23.84 41.51,23.83 | v48.1,54.55 v47,54.55
  Bottom 1.422: v30.9,12.3 33.4,14.8 36.25,14.8 37.9,16.35 37.9,19.34 | 41.49,23.84 41.5,25.99 44.01,28.5 v52.75,28.5 54.3,28.5 60.55,34.75 60.55,50.75 56.75,54.55 v48.1,54.55
  pour Top (no thermals): 46.25,49.8 46.25,56.2 46.85,56.85 50.45,56.85 50.85,56.3 50.85,49.9 50.35,49.45 46.65,49.45

### Text on the board
Top: PCB by Stefan Haller
tPlace: on BOT | +
tNames: Power | LPC1115 V1.0 DEV | Martin G, Stefan T, Stefan H